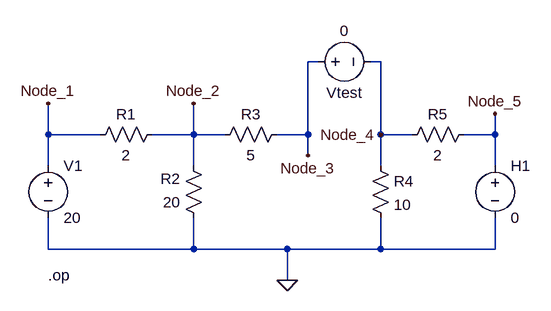
[diagram p0: schematic circuit_with_ccvs.asc]
circuit_with_ccvs.asc, the LTspice schematic file:
Version 4
SHEET 1 880 680
WIRE 480 0 464 0
WIRE 576 0 560 0
WIRE 64 112 64 64
WIRE 144 112 64 112
WIRE 288 112 288 64
WIRE 288 112 224 112
WIRE 336 112 288 112
WIRE 464 112 464 0
WIRE 464 112 416 112
WIRE 576 112 576 0
WIRE 624 112 576 112
WIRE 752 112 752 80
WIRE 752 112 704 112
WIRE 464 144 464 112
WIRE 64 160 64 112
WIRE 288 160 288 112
WIRE 576 160 576 112
WIRE 752 160 752 112
WIRE 64 288 64 240
WIRE 288 288 288 240
WIRE 288 288 64 288
WIRE 432 288 288 288
WIRE 576 288 576 240
WIRE 576 288 432 288
WIRE 752 288 752 240
WIRE 752 288 576 288
WIRE 432 336 432 288
FLAG 432 336 0
FLAG 64 64 Node_1
FLAG 288 64 Node_2
FLAG 464 144 Node_3
FLAG 576 112 Node_4
FLAG 752 80 Node_5
SYMBOL voltage 64 144 R0
WINDOW 123 0 0 Left 0
WINDOW 39 0 0 Left 0
SYMATTR InstName V1
SYMATTR Value 20
SYMBOL res 240 96 R90
WINDOW 0 0 56 VBottom 2
WINDOW 3 32 56 VTop 2
SYMATTR InstName R1
SYMATTR Value 2
SYMBOL res 304 256 R180
WINDOW 0 36 76 Left 2
WINDOW 3 36 40 Left 2
SYMATTR InstName R2
SYMATTR Value 20
SYMBOL res 320 128 R270
WINDOW 0 32 56 VTop 2
WINDOW 3 0 56 VBottom 2
SYMATTR InstName R3
SYMATTR Value 5
SYMBOL res 560 144 R0
SYMATTR InstName R4
SYMATTR Value 10
SYMBOL res 720 96 R90
WINDOW 0 0 56 VBottom 2
WINDOW 3 32 56 VTop 2
SYMATTR InstName R5
SYMATTR Value 2
SYMBOL voltage 752 144 R0
WINDOW 123 0 0 Left 0
WINDOW 39 0 0 Left 0
SYMATTR InstName H1
SYMATTR Value 0
SYMBOL voltage 464 0 R270
WINDOW 0 -32 56 VBottom 2
WINDOW 3 32 56 VTop 2
WINDOW 123 0 0 Left 0
WINDOW 39 0 0 Left 0
SYMATTR InstName Vtest
SYMATTR Value 0
TEXT 64 328 Left 2 !.op

The netlist it stands for:
* circuit_with_ccvs.asc
V1 Node_1 0 20
R1 Node_2 Node_1 2
R2 0 Node_2 20
R3 Node_2 Node_3 5
R4 Node_4 0 10
R5 Node_5 Node_4 2
V§H1 Node_5 0 0
Vtest Node_3 Node_4 0
.op
.backanno
.end

* Results of the author's LTspice run, read from the files saved beside the schematic
* Operating Point:
*   V(node_1) = 20 V
*   V(node_2) = 14.29 V
*   V(node_3) = 3.571 V
*   V(node_4) = 3.571 V
*   V(node_5) = 0 V
*   I(R5) = -1.786 A
*   I(R4) = 357.1 mA
*   I(R3) = 2.143 A
*   I(R2) = -714.3 mA
*   I(R1) = -2.857 A
*   I(Vtest) = 2.143 A
*   I(H1) = 1.786 A
*   I(V1) = -2.857 A